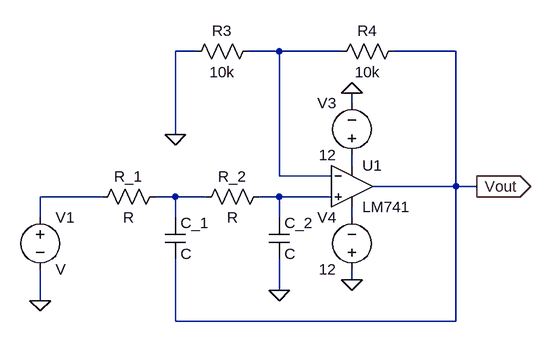
[diagram p0: schematic Draft2.asc]
Draft2.asc, the LTspice schematic file:
Version 4
SHEET 1 880 680
WIRE -16 -48 -48 -48
WIRE 112 -48 64 -48
WIRE 208 -48 112 -48
WIRE 384 -48 288 -48
WIRE 224 32 224 16
WIRE -48 80 -48 -48
WIRE 224 128 224 112
WIRE 112 144 112 -48
WIRE 192 144 112 144
WIRE 384 160 384 -48
WIRE 384 160 256 160
WIRE 416 160 384 160
WIRE -160 176 -256 176
WIRE -48 176 -80 176
WIRE 0 176 -48 176
WIRE 112 176 80 176
WIRE 192 176 112 176
WIRE -256 208 -256 176
WIRE -48 208 -48 176
WIRE 112 208 112 176
WIRE 224 208 224 192
WIRE 224 304 224 288
WIRE 112 320 112 272
WIRE -256 336 -256 288
WIRE -48 368 -48 272
WIRE 384 368 384 160
WIRE 384 368 -48 368
FLAG 112 320 0
FLAG -256 336 0
FLAG -48 80 0
FLAG 416 160 Vout
IOPIN 416 160 Out
FLAG 224 16 0
FLAG 224 304 0
SYMBOL OpAmps\\LM741 224 96 R0
SYMATTR InstName U1
SYMBOL cap 96 208 R0
SYMATTR InstName C_2
SYMBOL res 96 160 R90
WINDOW 0 0 56 VBottom 2
WINDOW 3 32 56 VTop 2
SYMATTR InstName R_2
SYMBOL cap -64 208 R0
SYMATTR InstName C_1
SYMBOL res -64 160 R90
WINDOW 0 0 56 VBottom 2
WINDOW 3 32 56 VTop 2
SYMATTR InstName R_1
SYMBOL voltage -256 192 R0
SYMATTR InstName V1
SYMBOL res 80 -64 R90
WINDOW 0 0 56 VBottom 2
WINDOW 3 32 56 VTop 2
SYMATTR InstName R3
SYMATTR Value 10k
SYMBOL res 304 -64 R90
WINDOW 0 0 56 VBottom 2
WINDOW 3 32 56 VTop 2
SYMATTR InstName R4
SYMATTR Value 10k
SYMBOL voltage 224 128 R180
WINDOW 0 24 96 Left 2
WINDOW 3 24 16 Left 2
WINDOW 123 0 0 Left 0
WINDOW 39 0 0 Left 0
SYMATTR InstName V3
SYMATTR Value 12
SYMBOL voltage 224 304 R180
WINDOW 0 24 96 Left 2
WINDOW 3 24 16 Left 2
WINDOW 123 0 0 Left 0
WINDOW 39 0 0 Left 0
SYMATTR InstName V4
SYMATTR Value 12

The netlist it stands for:
* Draft2.asc
XU1 N005 N001 N002 N006 Vout LM741  ; pins In+ In- V+ V- OUT
C_2 N005 0 C
R_2 N005 N004 R
C_1 N004 Vout C
R_1 N004 N003 R
V1 N003 0 V
R3 N001 0 10k
R4 Vout N001 10k
V3 N002 0 12
V4 0 N006 12
.lib LM741.lib
.backanno
.end